# Altium schematic sheet Memoria.SchDoc: CONTROLADORA MAIS PIPOCA - REVISÃO EMC
size A3; DocumentNumber: 15; SheetNumber: 15; SheetTotal: 17
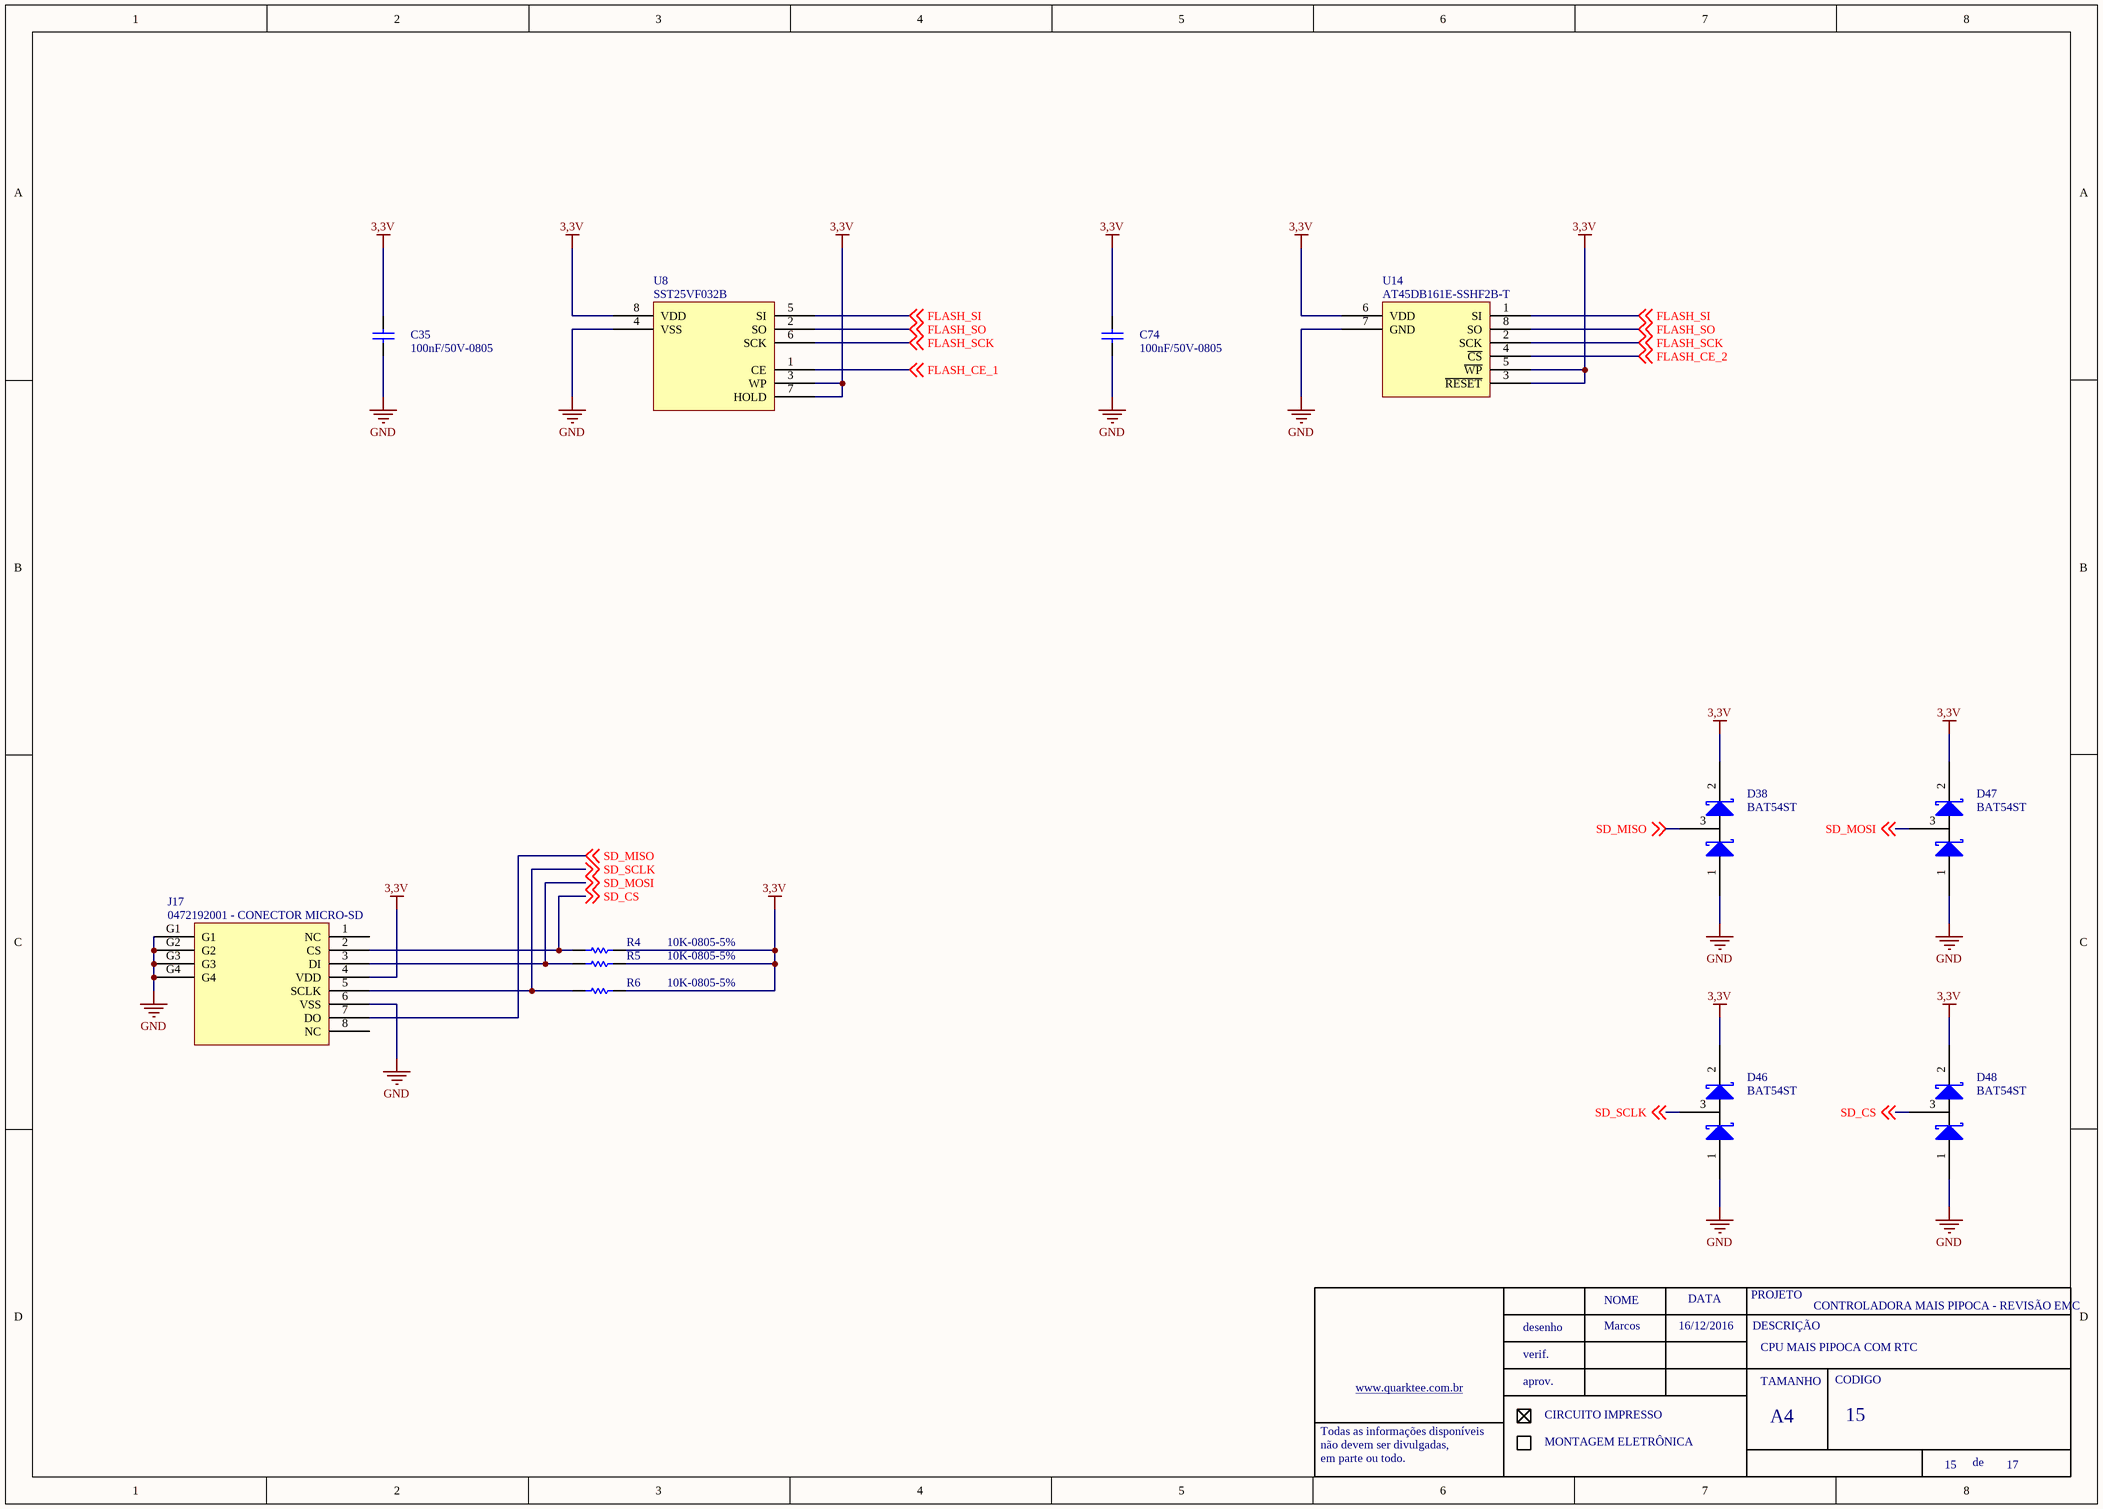
[diagram p0: Memoria.SchDoc]

## Parts
C35  100nF/50V-0805  [0805-REVISADO ONDA]
C74  100nF/50V-0805  [0805-REVISADO ONDA]
D38  BAT54ST  [SOT23 - REVISADO ONDA]
D46  BAT54ST  [SOT23 - REVISADO ONDA]
D47  BAT54ST  [SOT23 - REVISADO ONDA]
D48  BAT54ST  [SOT23 - REVISADO ONDA]
J17  0472192001 - CONECTOR MICRO-SD
R4  10K-0805-5%  [0805-REVISADO ONDA]
R5  10K-0805-5%  [0805-REVISADO ONDA]
R6  10K-0805-5%  [0805-REVISADO ONDA]
U8  SST25VF032B  [SOIC LARGO ATMEL]
U14  AT45DB161E-SSHF2B-T

## Nets
3,3V: C35.2 C74.2 D38.2 D46.2 D47.2 D48.2 J17.4(VDD) R4.1 R5.1 R6.1 U8.3(WP) U8.7(HOLD) U8.8(VDD) U14.3(~{RESET}) U14.5(~{WP}) U14.6(VDD)
GND: C35.1 C74.1 D38.1 D46.1 D47.1 D48.1 J17.6(VSS) J17.G1 J17.G2 J17.G3 J17.G4 U8.4(VSS) U14.7(GND)
FLASH_CE_1: U8.1(CE) ; off-sheet FLASH_CE_1
FLASH_CE_2: U14.4(~{CS}) ; off-sheet FLASH_CE_2
FLASH_SCK: U8.6(SCK) U14.2(SCK) ; off-sheet FLASH_SCK
FLASH_SI: U8.5(SI) U14.1(SI) ; off-sheet FLASH_SI
FLASH_SO: U8.2(SO) U14.8(SO) ; off-sheet FLASH_SO
SD_CS: D48.3 J17.2(CS) R4.2 ; off-sheet SD_CS
SD_MISO: D38.3 J17.7(DO) ; off-sheet SD_MISO
SD_MOSI: D47.3 J17.3(DI) R5.2 ; off-sheet SD_MOSI
SD_SCLK: D46.3 J17.5(SCLK) R6.2 ; off-sheet SD_SCLK

Not connected (* = marked no-connect by the designer): J17 1(NC) 8(NC)

## Notes on the sheet
- Marcos
- 16/12/2016
- CPU MAIS PIPOCA COM RTC
- NOME
- DATA
- PROJETO
- DESCRIÇÃO
- www.quarktee.com.br
- desenho
- verif.
- aprov.
- TAMANHO
- CODIGO
- Todas as informações disponíveis
- não devem ser divulgadas,
- em parte ou todo.
- CIRCUITO IMPRESSO
- MONTAGEM ELETRÔNICA
- A4
- de

## Library data of the parts
C35 C74 = 100nF/50-0805-NPO: ERP: 104.11.005
J17 = CONECTOR MICRO-SD
U8 = SST25VF032B: ERP: FALTA CADASTRAR
R4-R6 = 10K-0805-5%: ERP: 102.11.054